# Altium project 51mian.PrjPcb
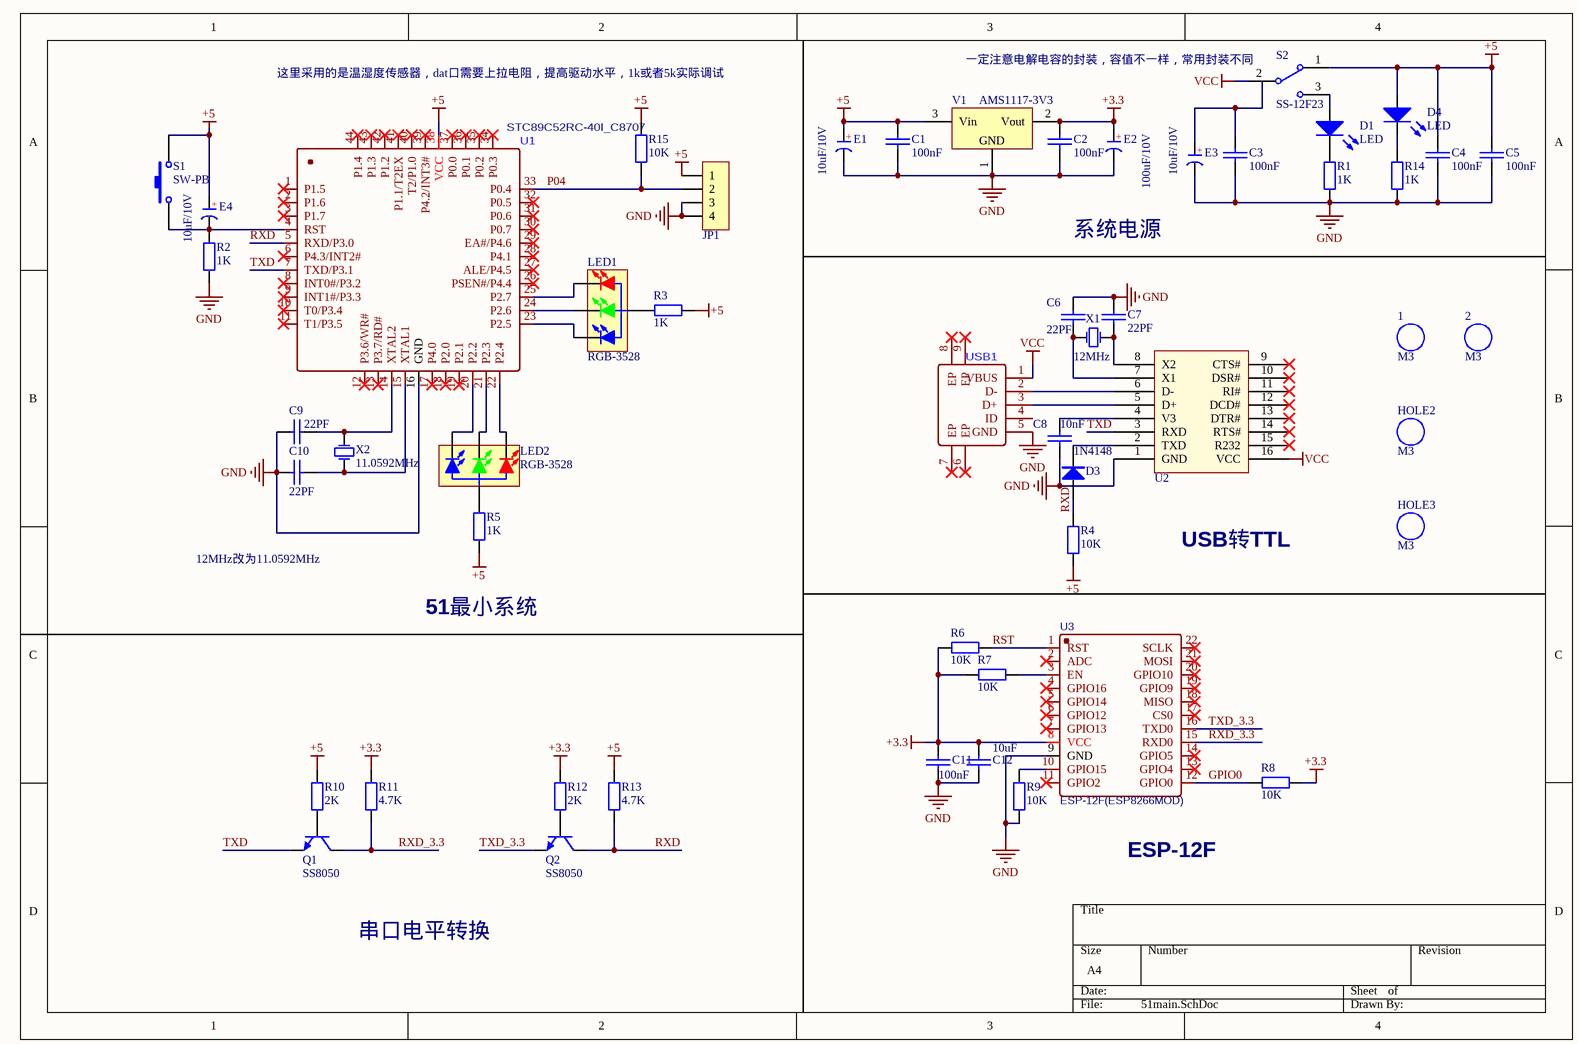
[diagram p0: 51main.SchDoc]
1 sheet, 52 parts. Net scope: global (net labels, ports and power ports of the same name join across sheets).
Board file: 51main（终版）.PcbDoc

## Sheet 51main.SchDoc
size A4

### Parts
1  M3  [M3 125X200]
2  M3  [M3 125X200]
C1  100nF  [0805C]
C2  100nF  [0805C]
C3  100nF  [0805C]
C4  100nF  [0805C]
C5  100nF  [0805C]
C6  22PF  [0805C]
C7  22PF  [0805C]
C8  10nF  [0805C]
C9  22PF  [0805C]
C10  22PF  [0805C]
C11  100nF  [0805C]
C12  10uF  [0805C]
D1  LED  [0805D]
D3  1N4148  [SOD-323]
D4  LED  [0805D]
E1  10uF/10V  [CM B(4*5.4)]
E2  100uF/10V  [CM C(5*5.4)]
E3  10uF/10V  [CM B(4*5.4)]
E4  10uF/10V  [CM B(4*5.4)]
HOLE2  M3  [M3 125X200]
HOLE3  M3  [M3 125X200]
JP1  HDR-1X4  [HDR2.54-M-LI-4P]  (value not drawn)
LED1  RGB-3528  [LED 3528-4Pin]
LED2  RGB-3528  [LED 3528-4Pin]
Q1  SS8050  [SOT23-3N]
Q2  SS8050  [SOT23-3N]
R1  1K  [R 0805_L]
R2  1K  [R 0805_L]
R3  1K  [R 0805_L]
R4  10K  [R 0805_L]
R5  1K  [R 0805_L]
R6  10K  [R 0805_L]
R7  10K  [R 0805_L]
R8  10K  [R 0805_L]
R9  10K  [R 0805_L]
R10  2K  [R 0805_L]
R11  4.7K  [R 0805_L]
R12  2K  [R 0805_L]
R13  4.7K  [R 0805_L]
R14  1K  [R 0805_L]
R15  10K  [R 0805_L]
S1  SW-PB  [SW_PB2_A1]
S2  SS-12F23  [MSK-12C01-07]
U1  STC89C52RC-40I_C8707  [PCBComponent_1 - duplicate]
U2  CH340G  [sop16_L]  (value not drawn)
U3  ESP-12F(ESP8266MOD)  [WIFIM-SMD_ESP-12F-ESP8266MOD]
USB1  (no value)  [MICRO-USB-1]
V1  AMS1117-3V3  [SOT223_L]
X1  12MHz  [OSC 5032-2P]
X2  11.0592MHz  [OSC 5032-2P]

### Nets
+3.3: C2.2 C11.2 C12.2 E2.1(A) R6.2 R7.2 R8.1 R11.1 R12.1 U3.8(VCC) V1.2(Vout)
+5: C1.2 C4.2 C5.2 D4.1(A) E1.1(A) E4.1(A) JP1.1 R3.1 R4.1 R5.1 R10.1 R13.1 R15.2 S1.2 S2.1 U1.38(VCC) V1.3(Vin)
GND: C1.1 C2.1 C3.1 C4.1 C5.1 C6.2 C7.2 C8.1 C9.1 C10.1 C11.1 C12.1 E1.2(K) E2.2(K) E3.2(K) JP1.3 JP1.4 R1.1 R2.1 R9.2 R14.1 U1.16(GND) U2.1(GND) U3.9(GND) USB1.5(GND) V1.1(GND)
VCC: S2.2 U2.16(VCC) USB1.1(VBUS)
GPIO0: R8.2 U3.12(GPIO0)
P04: JP1.2 R15.1 U1.33(P0.4)
RST: R6.1 U3.1(RST)
RXD: D3.1(A) Q2.3(C) R4.2 R13.2 U1.5(RXD/P3.0)
RXD_3.3: Q1.3(C) R11.2 U3.15(RXD0)
TXD: Q1.2(E) U1.7(TXD/P3.1) U2.3(RXD)
TXD_3.3: Q2.2(E) U3.16(TXD0)
NetC3_2: C3.2 E3.1(A)
NetC6_1: C6.1 U2.7(X1) X1.2(OSC2)
NetC7_1: C7.1 U2.8(X2) X1.1(OSC1)
NetC8_2: C8.2 U2.4(V3)
NetC9_2: C9.2 U1.14(XTAL2) X2.2(OSC2)
NetC10_2: C10.2 U1.15(XTAL1) X2.1(OSC1)
NetD1_1: D1.1(A) S2.3
NetD1_2: D1.2(K) R1.2
NetD3_2: D3.2(K) U2.2(TXD)
NetD4_2: D4.2(K) R14.2
NetE4_2: E4.2(K) R2.2 S1.1 U1.4(RST)
NetLED1_1: LED1.1(RED_K) U1.25(P2.7)
NetLED1_2: LED1.2(GREEN_K) U1.24(P2.6)
NetLED1_3: LED1.3(BULE_K) U1.23(P2.5)
NetLED1_4: LED1.4(A) R3.2
NetLED2_1: LED2.1(RED_K) U1.22(P2.4)
NetLED2_2: LED2.2(GREEN_K) U1.21(P2.3)
NetLED2_3: LED2.3(BULE_K) U1.20(P2.2)
NetLED2_4: LED2.4(A) R5.2
NetQ1_1: Q1.1(B) R10.2
NetQ2_1: Q2.1(B) R12.2
NetR7_1: R7.1 U3.3(EN)
NetR9_1: R9.1 U3.10(GPIO15)
NetU2_5: U2.5(D+) USB1.3(D+)
NetU2_6: U2.6(D-) USB1.2(D-)

Not connected (* = marked no-connect by the designer): U1 1(P1.5)* 2(P1.6)* 3(P1.7)* 6(P4.3/INT2#)* 8(INT0#/P3.2)* 9(INT1#/P3.3)* 10(T0/P3.4)* 11(T1/P3.5)* 12(P3.6/WR#)* 13(P3.7/RD#)* 17(P4.0)* 18(P2.0)* 19(P2.1)* 26(PSEN#/P4.4)* 27(ALE/P4.5)* 28(P4.1)* 29(EA#/P4.6)* 30(P0.7)* 31(P0.6)* 32(P0.5)* 34(P0.3)* 35(P0.2)* 36(P0.1)* 37(P0.0)* 39(P4.2/INT3#)* 40(T2/P1.0)* 41(P1.1/T2EX)* 42(P1.2)* 43(P1.3)* 44(P1.4)*; U2 9(CTS#)* 10(DSR#)* 11(RI#)* 12(DCD#)* 13(DTR#)* 14(RTS#)* 15(R232)*; U3 2(ADC)* 4(GPIO16)* 5(GPIO14)* 6(GPIO12)* 7(GPIO13)* 11(GPIO2)* 13(GPIO4)* 14(GPIO5)* 17(CS0)* 18(MISO)* 19(GPIO9)* 20(GPIO10)* 21(MOSI)* 22(SCLK)*; USB1 4(ID) 6(EP)* 7(EP)* 8(EP)* 9(EP)*

### Notes on the sheet
- 这里采用的是温湿度传感器，dat口需要上拉电阻，提高驱动水平，1k或者5k实际调试
- 一定注意电解电容的封装，容值不一样，常用封装不同
- 系统电源
- 12MHz改为11.0592MHz
- USB转TTL
- 51最小系统
- ESP-12F
- 串口电平转换
- (in symbol CE_SMD) +

### Library data of the parts
1 2 = M3: 铜柱孔; 版权归属: 封装库来自淘宝 ID：黄晶宝石; BOM名称: 铜柱孔; 学习资源: https://shop463601444.taobao.com
C1-C12 = CAP: Capacitor
D3 = 1N4148: 开关二极管; BOM名称: 高速开关二极管; 淘宝ID: 封装库来自淘宝 ID：黄晶宝石; 欢迎光临: https://shop463601444.taobao.com
E1-E4 = CE_SMD: 贴片电解电容; 版权归属: 封装库来自淘宝 ID：黄晶宝石; BOM名称: 贴片电解电容; 联系售后: https://shop463601444.taobao.com
HOLE2 HOLE3 = M3: 铜柱孔; 版权归属: 源创客; BOM名称: 铜柱孔; 学习资源: www.ooocke.com
JP1 = Header 4: 4P接插件; 版权归属: 封装库来自淘宝 ID：黄晶宝石; BOM名称: 4P接插件; 学习资源: https://shop463601444.taobao.com
LED1 LED2 = LED-RGB 3528: 3528三基色LED; BOM名称: 三基色LED; 版权归属: 封装库来自淘宝 ID：黄晶宝石; 封装库来自淘宝卖家 ID：黄晶宝石: 其他店铺购入均为盗版，不享受售后技术支持服务，请立即申请退款; 学习资源: https://shop463601444.taobao.com
Q1 Q2 = 8050-SMD: 高频放大-NPN型; 版权归属: 封装库来自淘宝 ID：黄晶宝石; 属性: 40V 1.5A 1W 100MHZ; BOM名称: 高频放大-NPN型; 联系售后: https://shop463601444.taobao.com
R1-R15 = R: 贴片电阻; 版权归属: 来自淘宝 ID：黄晶宝石; 封装库来自淘宝卖家 ID：黄晶宝石: 其他店铺购入均为盗版，不享受售后技术支持服务，请立即申请退款; BOM名称: 贴片电阻; 联系售后: https://shop463601444.taobao.com
S1 = SW-PB: 微动开关; Published: 24-Mar-1999; LatestRevisionDate: 17-Jul-2002; LatestRevisionNote: Re-released for DXP Platform.; PackageReference: SPST-2; Publisher: Altium Limited
S2 = SSW-1P: 1路波动开关; BOM名称: 波动开关; 版权归属: 封装库来自淘宝 ID：黄晶宝石; 学习资源: https://shop463601444.taobao.com
U2 = CH340G: 技术支持，联系售后: 封装库来自淘宝卖家 ID：黄晶宝石; 唯一出售店铺网址: https://shop463601444.taobao.com
U3 = ESP-12F(ESP8266MOD): BOM_Manufacturer: Ai-Thinker; BOM_Supplier: LCSC; BOM_Manufacturer Part: ESP-12F(ESP8266MOD); BOM_Supplier Part: C82891; BOM_JLCPCB Part Class: Extended Part; spicePre: U; spiceSymbolName: ESP-12F(ESP8266MOD)
USB1 = U-F-M5DS-Y-7
V1 = AMS1117: 三端稳压芯片; BOM名称: 稳压芯片; 淘宝ID: 封装库来自淘宝 ID：黄晶宝石; 欢迎光临淘宝店铺: https://shop463601444.taobao.com
X1 X2 = XTAL